# Altium schematic sheet LT3045 and LT3094.SchDoc
size A4
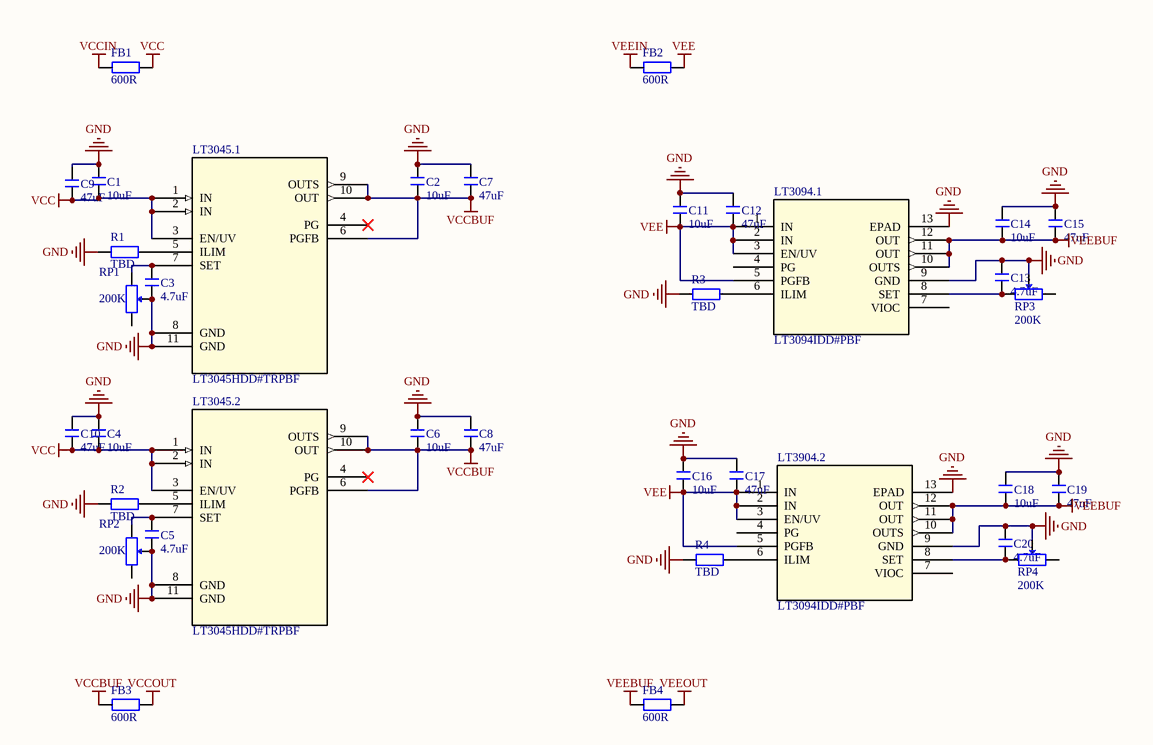
[diagram p0: LT3045 and LT3094.SchDoc]

## Parts
C1  10uF  [C 0603_L]
C2  10uF  [C 0603_L]
C3  4.7uF  [C 0603_L]
C4  10uF  [C 0603_L]
C5  4.7uF  [C 0603_L]
C6  10uF  [C 0603_L]
C7  47uF  [C 0603_L]
C8  47uF  [C 0603_L]
C9  47uF  [C 0603_L]
C10  47uF  [C 0603_L]
C11  10uF  [C 0603_L]
C12  47uF  [C 0603_L]
C13  4.7uF  [C 0603_L]
C14  10uF  [C 0603_L]
C15  47uF  [C 0603_L]
C16  10uF  [C 0603_L]
C17  47uF  [C 0603_L]
C18  10uF  [C 0603_L]
C19  47uF  [C 0603_L]
C20  4.7uF  [C 0603_L]
FB1  600R  [FB-0805]
FB2  600R  [FB-0805]
FB3  600R  [FB-0805]
FB4  600R  [FB-0805]
LT3045.1  LT3045HDD#TRPBF  [DD_10_ADI-M]
LT3045.2  LT3045HDD#TRPBF  [DD_10_ADI-M]
LT3094.1  LT3094IDD#PBF  [DFN_12_ADI-L]
LT3904.2  LT3094IDD#PBF  [DFN_12_ADI-L]
R1  TBD  [R 0603_L]
R2  TBD  [R 0603_L]
R3  TBD  [R 0603_L]
R4  TBD  [R 0603_L]
RP1  200K  [3296W]
RP2  200K  [3296W]
RP3  200K  [3296W]
RP4  200K  [3296W]

## Nets
GND: C1.2 C2.2 C3.1 C4.2 C5.1 C6.2 C7.2 C8.2 C9.2 C10.2 C11.2 C12.2 C13.1 C14.2 C15.2 C16.2 C17.2 C18.2 C19.2 C20.1 LT3045.1.8(GND) LT3045.1.11(GND) LT3045.2.8(GND) LT3045.2.11(GND) LT3094.1.9(GND) LT3094.1.13(EPAD) LT3904.2.9(GND) LT3904.2.13(EPAD) R1.1 R2.1 R3.1 R4.1 RP1.2 RP2.2 RP3.2 RP4.2
VCC: C1.1 C4.1 C9.1 C10.1 FB1.2 LT3045.1.1(IN) LT3045.1.2(IN) LT3045.1.3(EN/UV) LT3045.2.1(IN) LT3045.2.2(IN) LT3045.2.3(EN/UV)
VCCBUF: C2.1 C6.1 C7.1 C8.1 FB3.1 LT3045.1.6(PGFB) LT3045.1.9(OUTS) LT3045.1.10(OUT) LT3045.2.6(PGFB) LT3045.2.9(OUTS) LT3045.2.10(OUT)
VCCIN: FB1.1
VCCOUT: FB3.2
VEE: C11.1 C12.1 C16.1 C17.1 FB2.2 LT3094.1.1(IN) LT3094.1.2(IN) LT3094.1.3(EN/UV) LT3094.1.5(PGFB) LT3904.2.1(IN) LT3904.2.2(IN) LT3904.2.3(EN/UV) LT3904.2.5(PGFB)
VEEBUF: C14.1 C15.1 C18.1 C19.1 FB4.1 LT3094.1.10(OUTS) LT3094.1.11(OUT) LT3094.1.12(OUT) LT3904.2.10(OUTS) LT3904.2.11(OUT) LT3904.2.12(OUT)
VEEIN: FB2.1
VEEOUT: FB4.2
NetC3_2: C3.2 LT3045.1.7(SET) RP1.1
NetC5_2: C5.2 LT3045.2.7(SET) RP2.1
NetC13_2: C13.2 LT3094.1.8(SET) RP3.1
NetC20_2: C20.2 LT3904.2.8(SET) RP4.1
NetLT3045.1_5: LT3045.1.5(ILIM) R1.2
NetLT3045.2_5: LT3045.2.5(ILIM) R2.2
NetLT3094.1_6: LT3094.1.6(ILIM) R3.2
NetLT3904.2_6: LT3904.2.6(ILIM) R4.2

Not connected (* = marked no-connect by the designer): LT3045.1 4(PG)*; LT3045.2 4(PG)*; LT3094.1 4(PG) 7(VIOC); LT3904.2 4(PG) 7(VIOC); RP1 3; RP2 3; RP3 3; RP4 3

## Library data of the parts
C1-C20 = C: 无极性贴片电容; 版权归属: 源创客; BOM名称: 无极性贴片电容; 学习资源: www.ooocke.com
FB1-FB4 = FB
LT3045.1 LT3045.2 = LT3045HDD#TRPBF: No Description Available; Built_By: EMA_Jessica; Vendor: Analog Devices Inc; SourceLibrary: Analog_Devices_2018-09-28; Copyright: Copyright (C) 2016 Accelerated Designs. All rights reserved; Manufacturer_Part_Number: LT3045HDD#TRPBF; RefDes: RefDes; Type: DEV
LT3094.1 LT3904.2 = LT3094IDD#PBF: No Description Available; Vendor: Analog Devices Inc; Built_By: EMA_Jessica; SourceLibrary: Analog_Devices_2020-01-02; Manufacturer_Part_Number: LT3094IDD#PBF; Copyright: Copyright (C) 2018 Accelerated Designs. All rights reserved; RefDes: RefDes; Type: DEV
R1-R4 = R: 贴片电阻; 版权归属: 源创客; BOM名称: 贴片电阻; 学习资源: www.ooocke.com
RP1-RP4 = RP-ID: 插件单联电位器; BOM名称: 插件电位器; 版权归属: 源创客; 学习资源: www.ooocke.com